# Altium schematic sheet TDesktop.SchDoc
size A4; Organization: Altium Limited; Address1: L3, 12a Rodborough Rd; Address2: Frenchs Forest; Address3: NSW; Address4: Australia 2086; DocumentNumber: 6; SheetNumber: 6; SheetTotal: 7
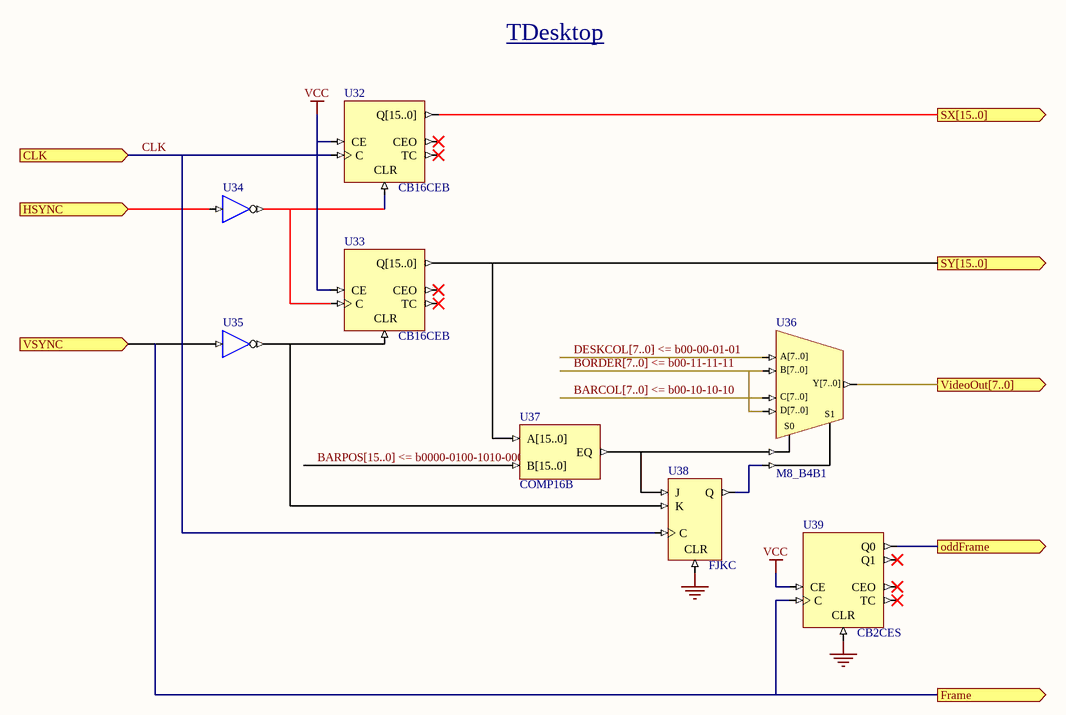
[diagram p0: TDesktop.SchDoc]

## Parts
U32  CB16CEB
U33  CB16CEB
U34  INV  (value not drawn)
U35  BUF  (value not drawn)
U36  M8_B4B1
U37  COMP16B
U38  FJKC
U39  CB2CES

## Ports
CLK (in), Frame (out), HSYNC (in), oddFrame (out), SX[15..0] (out), SY[15..0] (out), VideoOut[7..0] (out), VSYNC (in)

## Nets
GND: U38.CLR U39.CLR
VCC: U32.CE U33.CE U39.CE
BARCOL[7..0] <= b00-10-10-10: U36.C[7..0]
BARPOS[15..0] <= b0000-0100-1010-000: U37.B[15..0]
BORDER[7..0] <= b00-11-11-11: U36.B[7..0] U36.D[7..0]
CLK: U32.C U38.C ; port CLK
DESKCOL[7..0] <= b00-00-01-01: U36.A[7..0]
Frame: U35.I U39.C ; port VSYNC, port Frame
HSYNC: U34.I ; port HSYNC
oddFrame: U39.Q0 ; port oddFrame
SX[15..0]: U32.Q[15..0] ; port SX[15..0]
SY[15..0]: U33.Q[15..0] U37.A[15..0] ; port SY[15..0]
VideoOut[7..0]: U36.Y[7..0] ; port VideoOut[7..0]
NetU32_CLR: U32.CLR U33.C U34.O
NetU33_CLR: U33.CLR U35.O U38.K
NetU36_S0: U36.S0 U37.EQ U38.J
NetU36_S1: U36.S1 U38.Q

Not connected (* = marked no-connect by the designer): U32 CEO* TC*; U33 CEO* TC*; U39 CEO* Q1* TC*

## Buses and harness runs
bus BARCOL[7..0] <= b00-10-10-10
bus BARPOS[15..0] <= b0000-0100-1010-000
bus BORDER[7..0] <= b00-11-11-11
bus DESKCOL[7..0] <= b00-00-01-01

## Notes on the sheet
- TDesktop
- Title
- Size:
- Date:
- A4
- Number:
- Time:
- Revision:
- Sheet
- of
- File:

## Library data of the parts
U32 U33 = CB16CEB: 16-Bit Cascadable Binary Counters with Clock Enable and Asynchronous Clear, Bus Version; Xilinx Equivalent: CB16CE; ArchiveName: GENERIC; VHDLIB_SIM: GENERIC_LIB; Published: 29-Jan-2004; Publisher: Altium Limited; Core Revision: 1.00.00
U34 U35 = INV: Inverter; ArchiveName: GENERIC; VHDLIB_SIM: GENERIC_LIB; Published: 29-Jan-2004; Publisher: Altium Limited; Xilinx Equivalent: INV; Core Revision: 1.00.00
U36 = M8_B4B1: 4x8-Bit Bus to 1x8-Bit Bus Multiplexer; ArchiveName: GENERIC; VHDLIB_SIM: GENERIC_LIB; Published: 29-Jan-2004; Publisher: Altium Limited; Core Revision: 1.00.00
U37 = COMP16B: 16-Bit Identity Comparator, Bus Version; Xilinx Equivalent: COMP16; ArchiveName: GENERIC; VHDLIB_SIM: GENERIC_LIB; Published: 29-Jan-2004; Publisher: Altium Limited; Core Revision: 1.00.00
U38 = FJKC: J-K Flip-Flop with Asynchronous Clear; ArchiveName: GENERIC; VHDLIB_SIM: GENERIC_LIB; Published: 29-Jan-2004; Publisher: Altium Limited; Xilinx Equivalent: FJKC; Core Revision: 1.00.00
U39 = CB2CES: 2-Bit Cascadable Binary Counters with Clock Enable and Asynchronous Clear, Single Pin Version; Xilinx Equivalent: CB2CE; ArchiveName: GENERIC; VHDLIB_SIM: GENERIC_LIB; Published: 29-Jan-2004; Publisher: Altium Limited; Core Revision: 1.00.00